# Altium schematic sheet guangmin.SchDoc
size A4
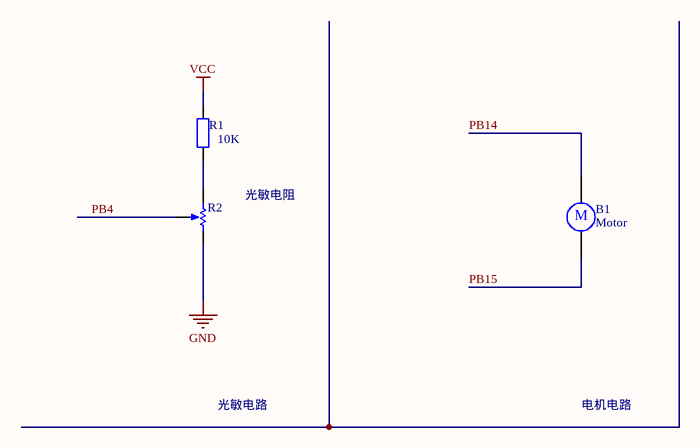
[diagram p0: guangmin.SchDoc]

## Parts
B1  Motor  [RB5-10.5]
R1  value 10K  [AXIAL-0.4]  (hidden comment: Res2)
R2  RPot  [VR5]  (value not drawn)

## Nets
GND: R2.2(BOT)
VCC: R1.2
PB4: R2.3(TAP)
PB14: B1.1
PB15: B1.2
NetR1_1: R1.1 R2.1(TOP)

## Notes on the sheet
- 光敏电阻
- 光敏电路
- 电机电路
- (in symbol Motor) M

## Library data of the parts
B1 = Motor: Motor, General Kind; Published: 24-Mar-1999; LatestRevisionDate: 17-Jul-2002; LatestRevisionNote: Re-released for DXP Platform.; PackageReference: RB5-10.5; Publisher: Altium Limited; PackageDescription: Capacitor (Radial); 2 Leads
R1 = Res2: Resistor; Published: 8-Jun-2000; LatestRevisionDate: 17-Jul-2002; LatestRevisionNote: Re-released for DXP Platform.; PackageReference: AXIAL-0.4; Publisher: Altium Limited; PackageDescription: Axial Device, Thru-Hole; 2 Leads; 0.4 in Pin Spacing
R2 = RPot: Potentiometer; Sim Note: Enter the Resistance value and the set point into parameter fields.; Set Position: 0.5; Value: 1K; Published: 8-Jun-2000; LatestRevisionDate: 17-Jul-2002; LatestRevisionNote: Re-released for DXP Platform.; PackageReference: VR5; Publisher: Altium Limited; PackageDescription: Variable Resistor, Thru-Hole; 3 Leads